# Altium schematic sheet power.SchDoc
size A4; Date: 08.06.2024; ApprovedBy: Jan Macheta; Author: Mikołaj Pichita; SheetNumber: 8; SheetTotal: 8
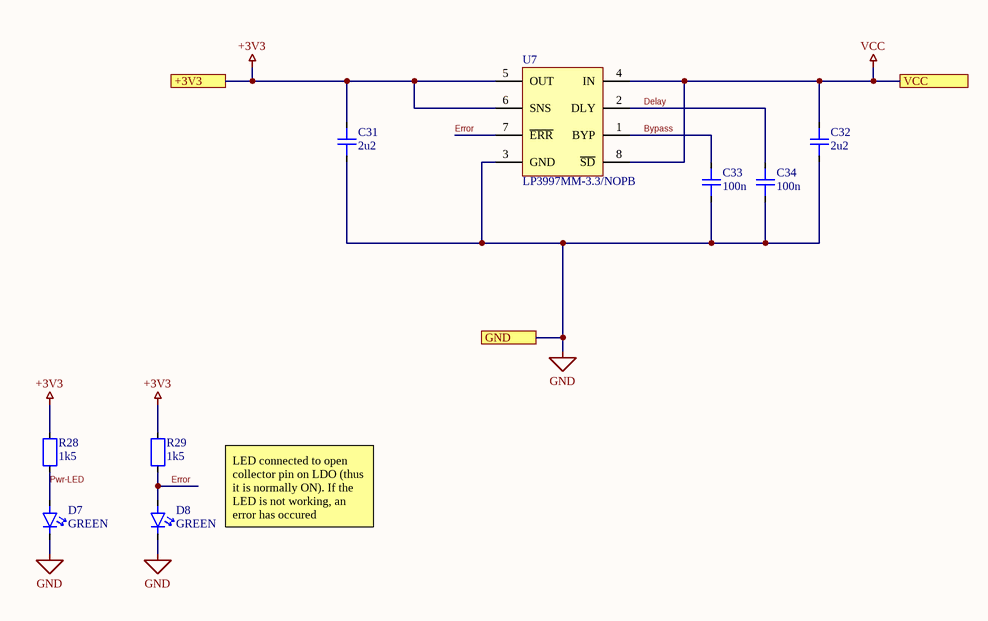
[diagram p0: power.SchDoc]

## Parts
C31  2u2  [CAP0603]
C32  2u2  [CAP0603]
C33  100n  [CAP0603]
C34  100n  [CAP0603]
D7  GREEN  [LED0603]
D8  GREEN  [LED0603]
R28  1k5  [RES0603]
R29  1k5  [RES0603]
U7  LP3997MM-3.3/NOPB  [DGK0008A_N]

## Ports
+3V3 (see main[4B], analog[4A], current_measurement[1C], microcontroller[4A], UART[1A], voltage_measurement[4D]), GND (see main[4B], analog[4A], current_measurement[1C], microcontroller[4A], UART[1A], voltage_measurement[4D]), VCC (see main[4B])

## Nets
+3V3: C31.1 R28.1 R29.1 U7.5(OUT) U7.6(SNS) ; port +3V3
GND: C31.2 C32.2 C33.2 C34.2 D7.2 D8.2 U7.3(GND) ; port GND
VCC: C32.1 U7.4(IN) U7.8(~{SD}) ; port VCC
Bypass: C33.1 U7.1(BYP)
Delay: C34.1 U7.2(DLY)
Error: D8.1 R29.2 U7.7(~{ERR})
Pwr-LED: D7.1 R28.2

## Notes on the sheet
- LED connected to open collector pin on LDO (thus it is normally ON). If the LED is not working, an error has occured
- Project name:
- Document name:
- Company name:
- Author:
- Reviewer:
- AGH University of Krakow
- Date:

## Library data of the parts
C31-C34 = Capacitor: Value: *; HelpURL: *; MPN: *; Supplier: *; SupplierPartNumber: *
D7 D8 = LED: Value: *; HelpURL: *; MPN: *; Supplier: *; SupplierPartNumber: *
R28 R29 = Resistor: Value: *; HelpURL: *; MPN: *; Supplier: *; SupplierPartNumber: *
U7 = LP3997MM-3.3/NOPB: Micropower 250mA CMOS LDO Regulator with Error Flag / Power-On-Reset, 8-pin Mini SOIC, Pb-Free; Manufacturer: Texas Instruments; CompType: LDO IC; PowerWise: N; PackageTopMarking: ZXTT*SAKB; ComponentLink1URL: http://www.ti.com/general/docs/lit/getliterature.tsp?genericPartNumber=LP3997&fileType=pdf; ComponentLink1Description: Datasheet URL; PackageReference: DGK0008A; PinCount: 8; RoHS: Y; Code_JEDEC: MO-187-AA; PackageDescription: MINI SOIC, .118 x .118 x .034in, 8 Lead, .0256in Pitch